# Altium project usb2ttl.PrjPCB
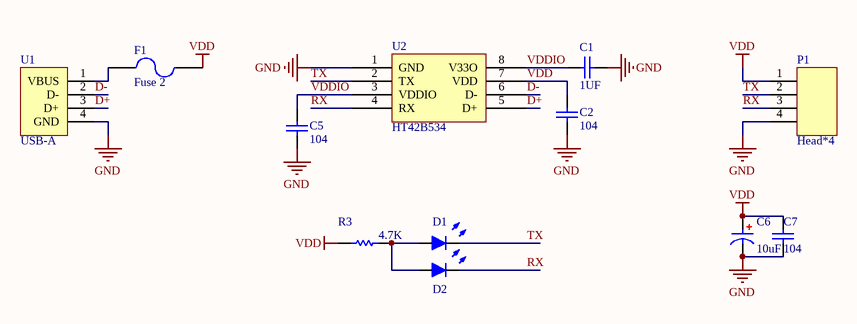
[diagram p0: usb2ttl.SchDoc]
1 sheet, 12 parts. Net scope: global (net labels, ports and power ports of the same name join across sheets).
Board file: usb2ttl.PcbDoc

## Sheet usb2ttl.SchDoc
size A4

### Parts
C1  C1uF  [0603C]  (value not drawn)
C2  104  [0603C]
C5  104  [0603C]
C6  C10uF  [0603C]  (value not drawn)
C7  104  [0603C]
D1  LED-G  [LED]  (value not drawn)
D2  LED-R  [LED]  (value not drawn)
F1  Fuse 2  [0805]
P1  Head*4  [HEAD*4]
R3  R4.7K  [0603R]  (value not drawn)
U1  USB-A  [USB-A]
U2  HT42B534  [SOP-8]

### Nets
GND: C1.1 C2.2 C5.2 C6.2 C7.1 P1.4 U1.4(GND) U2.1(GND)
VDD: C2.1 C6.1 C7.2 F1.2 P1.1 R3.1 U2.7(VDD)
D+: U1.3(D+) U2.5(D+)
D-: U1.2(D-) U2.6(D-)
RX: D2.2(K) P1.3 U2.4(RX)
TX: D1.2(K) P1.2 U2.2(TX)
VDDIO: C1.2 C5.1 U2.3(VDDIO) U2.8(V33O)
NetD1_1: D1.1(A) D2.1(A) R3.2
NetF1_1: F1.1 U1.1(VBUS)

### Notes on the sheet
- (in symbol C0.1uF) 1UF
- (in symbol C10uF) 10uF
- (in symbol R1K) 4.7K

### Library data of the parts
C1 C2 C5 C7 = C0.1uF
D1 D2 = LED
F1 = Fuse 2: Fuse; Published: 8-Jun-2000; LatestRevisionDate: 17-Jul-2002; LatestRevisionNote: Re-released for DXP Platform.; PackageReference: PIN-W2/E2.8; Publisher: Altium Limited; PackageDescription: Thru-Hole; 2 Leads
R3 = R1K